# Altium schematic sheet LCD.SchDoc
size A4
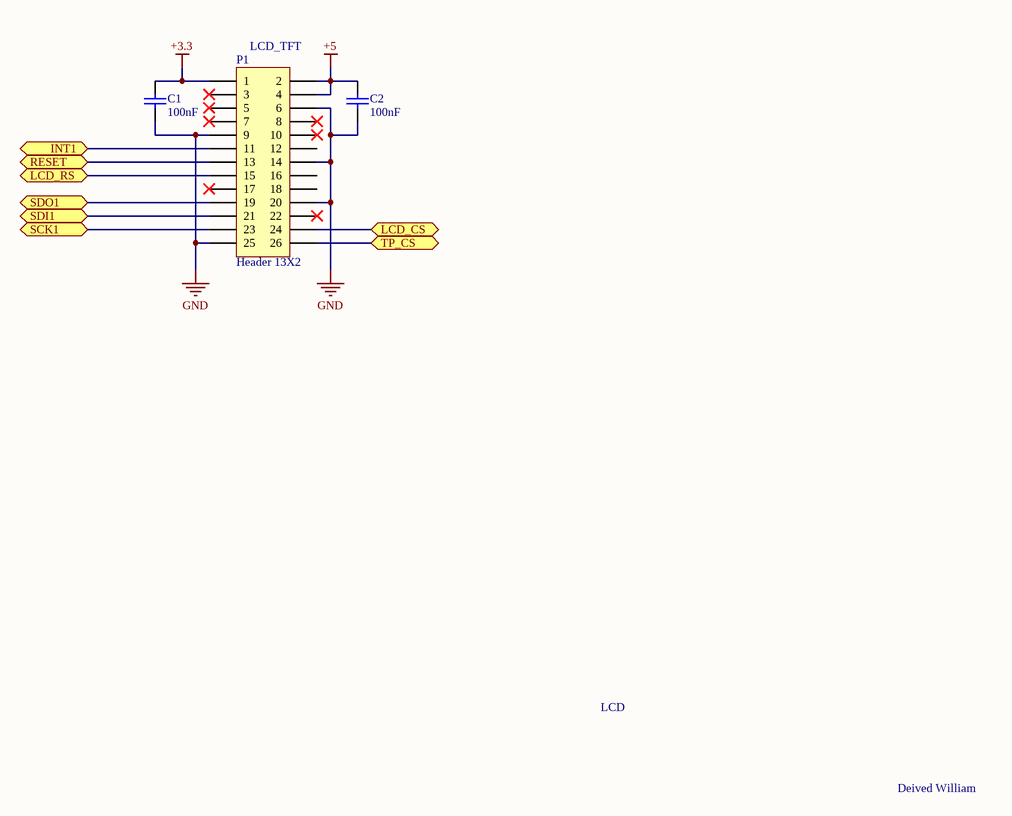
[diagram p0: LCD.SchDoc]

## Parts
C1  value 100nF  [WCAP-CSGP_0603, 1.6x0.8x0.8mm_Reflow]  (hidden comment: 885012206020)
C2  value 100nF  [WCAP-CSGP_0603, 1.6x0.8x0.8mm_Reflow]  (hidden comment: 885012206020)
P1  Header 13X2  [HDR2X13]

## Ports
INT1, LCD_CS, LCD_RS, RESET, SCK1, SDI1, SDO1, TP_CS

## Nets
+3.3: C1.2 P1.1
+5: C2.2 P1.2 P1.4
GND: C1.1 C2.1 P1.6 P1.9 P1.14 P1.20 P1.25
INT1: P1.11 ; port INT1
LCD_CS: P1.24 ; port LCD_CS
LCD_RS: P1.15 ; port LCD_RS
RESET: P1.13 ; port RESET
SCK1: P1.23 ; port SCK1
SDI1: P1.21 ; port SDI1
SDO1: P1.19 ; port SDO1
TP_CS: P1.26 ; port TP_CS

Not connected (* = marked no-connect by the designer): P1 3* 5* 7* 8* 10* 12 16 17* 18 22*

## Notes on the sheet
- (near P1) LCD_TFT
- LCD
- Deived William

## Library data of the parts
C1 C2 = 885012206020: WCAP-CSGP Ceramic Capacitors, size 0603, 1.6x0.8x0.8mm, 10V, X7R, 100nF; Rated Voltage: 10V DC; ComponentLink1Description: Manufacturer; ComponentLink1URL: http://www.we-online.de; ComponentLink2Description: Datasheet; ComponentLink2URL: http://katalog.we-online.de/pbs/datasheet/885012206020.pdf; Part Number: 885012206020; Published Date: June 2017; Publisher: Wurth Elektronik; Size: 0603, 1.6x0.8x0.8mm; Ceramic Type: X7R
P1 = Header 13X2: Header, 13-Pin, Dual row; LatestRevisionDate: 17-Jul-2002; LatestRevisionNote: Re-released for DXP Platform.; Publisher: Altium Limited